# Altium project Speedometer_Tech.PrjPcb
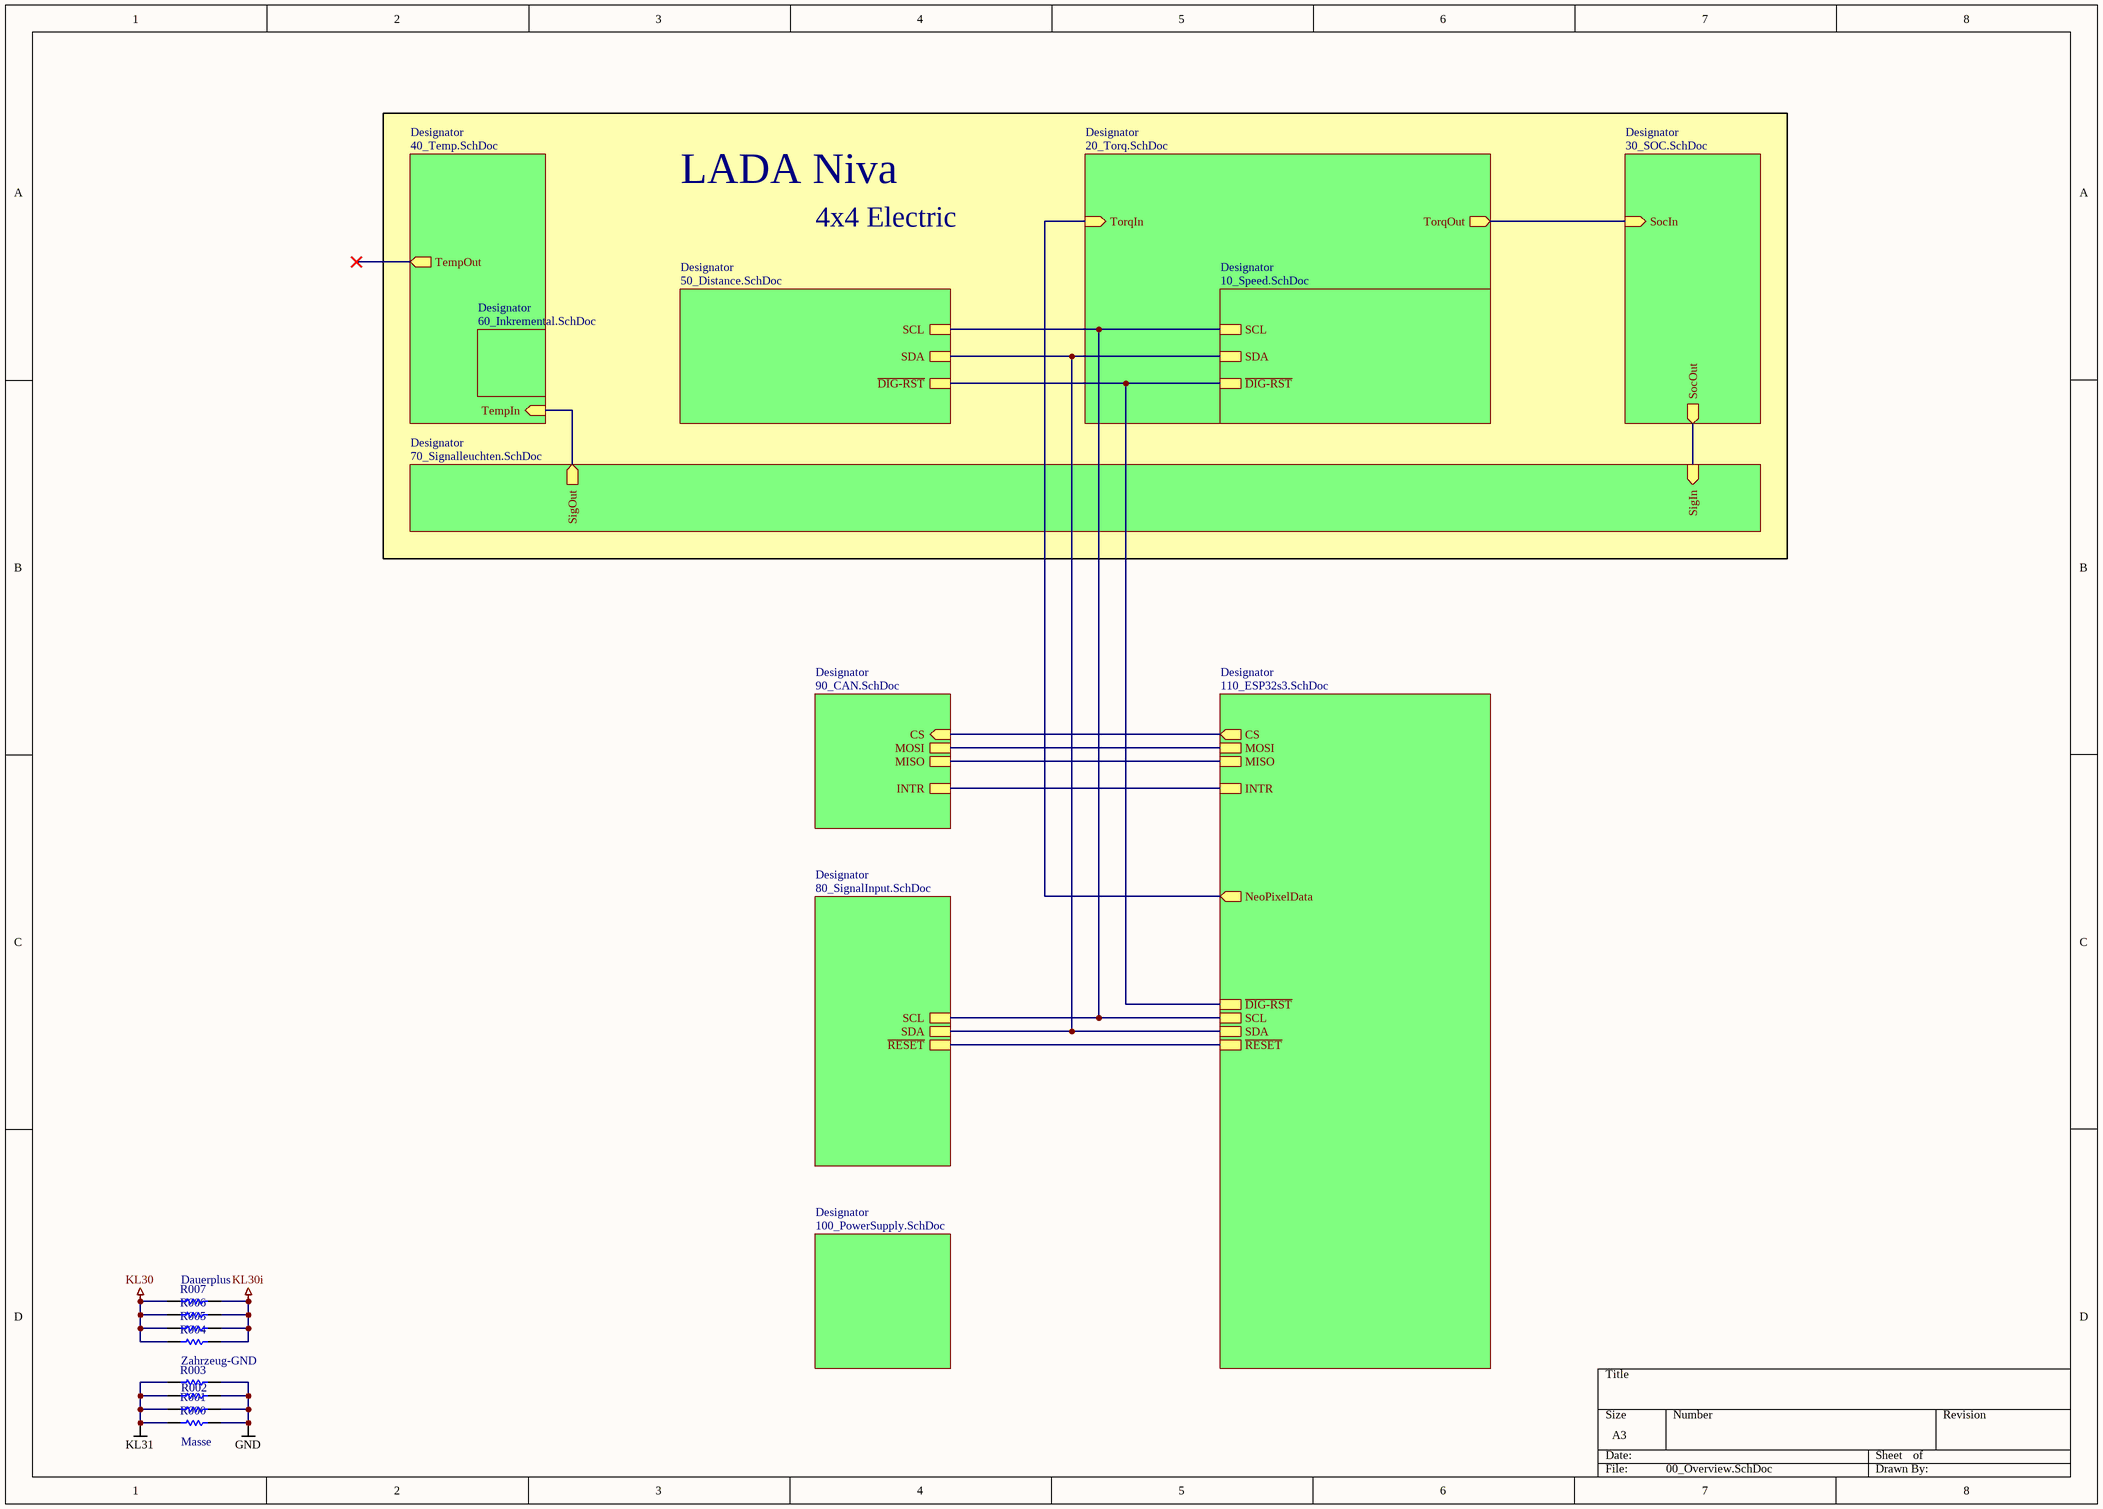
[diagram p0: 00_Overview.SchDoc]
5 sheets, 107 parts. Net scope: hierarchical (ports join the sheet entries above them; power ports are global).
Board file: Speedometer_Tech.PcbDoc
Sheets:
  00_Overview.SchDoc
    Designator = 10_Speed.SchDoc
    Designator = 50_Distance.SchDoc
    Designator = 100_PowerSupply.SchDoc
    Designator = 90_CAN.SchDoc

## Sheet 00_Overview.SchDoc
size A3; SheetNumber: 1; SheetTotal: 12

### Parts
R000  RC0603JR-070RL  [RESC1608X55X25ML10T15]  (value not drawn)
R001  RC0603JR-070RL  [RESC1608X55X25ML10T15]  (value not drawn)
R002  RC0603JR-070RL  [RESC1608X55X25ML10T15]  (value not drawn)
R003  RC0603JR-070RL  [RESC1608X55X25ML10T15]  (value not drawn)
R004  RC0603JR-070RL  [RESC1608X55X25ML10T15]  (value not drawn)
R005  RC0603JR-070RL  [RESC1608X55X25ML10T15]  (value not drawn)
R006  RC0603JR-070RL  [RESC1608X55X25ML10T15]  (value not drawn)
R007  RC0603JR-070RL  [RESC1608X55X25ML10T15]  (value not drawn)

### Sub-sheets
Designator = 110_ESP32s3.SchDoc (file not in this document): CS (out), INTR, MOSI, MISO, SCL, SDA, ~{RESET}, NeoPixelData (out), ~{DIG-RST}
Designator = 20_Torq.SchDoc (file not in this document): TorqIn (in), TorqOut (out)
Designator = 10_Speed.SchDoc: SCL, SDA, ~{DIG-RST}
Designator = 30_SOC.SchDoc (file not in this document): SocIn (in), SocOut (out)
Designator = 40_Temp.SchDoc (file not in this document): TempOut (out), TempIn (in)
Designator = 70_Signalleuchten.SchDoc (file not in this document): SigIn (in), SigOut (out)
Designator = 50_Distance.SchDoc: SCL, SDA, ~{DIG-RST}
Designator = 60_Inkremental.SchDoc (file not in this document): no entries
Designator = 80_SignalInput.SchDoc (file not in this document): SCL, SDA, ~{RESET}
Designator = 100_PowerSupply.SchDoc: no entries
Designator = 90_CAN.SchDoc: CS (in), INTR, MOSI, MISO

### Nets
GND: R000.2 R001.2 R002.2 R003.2
KL30: R004.1 R005.1 R006.1 R007.1
KL30i: R004.2 R005.2 R006.2 R007.2
KL31: R000.1 R001.1 R002.1 R003.1
~{DIG-RST}: sheet Designator/~{DIG-RST}, sheet Designator/~{DIG-RST}, sheet Designator/~{DIG-RST}
NetU100_18: sheet Designator/SCL, sheet Designator/SCL, sheet Designator/SCL, sheet Designator/SCL
NetU100_19: sheet Designator/SDA, sheet Designator/SDA, sheet Designator/SDA, sheet Designator/SDA
NetU901_12: sheet Designator/INTR, sheet Designator/INTR
NetU901_14: sheet Designator/MOSI, sheet Designator/MOSI
NetU901_15: sheet Designator/MISO, sheet Designator/MISO
NetU901_16: sheet Designator/CS, sheet Designator/CS
(unnamed): sheet Designator/~{RESET}, sheet Designator/~{RESET}
(unnamed): sheet Designator/NeoPixelData, sheet Designator/TorqIn
(unnamed): sheet Designator/TorqOut, sheet Designator/SocIn
(unnamed): sheet Designator/SocOut, sheet Designator/SigIn
(unnamed): sheet Designator/TempIn, sheet Designator/SigOut

### Notes on the sheet
- LADA Niva
- 4x4 Electric
- (near R007) Dauerplus
- Zahrzeug-GND
- (near R000) Masse

### Library data of the parts
R000 R001 R002 R003 R004 R005 R006 R007 = CMP-2100-03667-1: Chip Resistor, 0 Ohm, +/- 5%, 0.1 W, -55 to 155 degC, 0603 (1608 Metric), RoHS, Tape and Reel; Manufacturer: Yageo; Temperature Coefficient: 200ppm/degreesC; Voltage Rating: 50V; Power Rating: 100mW; Resistance: 0mOhm; Width: 0.8mm; Max Operating Temperature: 155degC; Tolerance: 5%; Package Reference: 0603; Height: 0.45mm; Depth: 0.8mm; Package Description: 2-Pin Surface Mount Device, Body 1.6 x 0.8 mm; Termination: SMD/SMT; Package Quantity: 5000; Case/Package: 0603; Case Code (Imperial): 0603; Radiation Hardening: No; Number of Pins: 2; Length: 1.6mm; Lead Free: LeadFree; Voltage Rating (DC): 50V; Military Standard: Not; Datasheet URL: http://www.yageo.com/NewPortal/yageodocoutput?fileName=/pdf/R-Chip/PYu-RC_Group_51_RoHS_L_5.pdf; Manufacturer URL: http://www.yageo.com/; Packaging: TapeandReel; Case Code (Metric): 1608; Min Operating Temperature: -55degC; Composition: ThickFilm; RoHSCompliant: true; Contact Plating: Tin; Datasheet Version: Rev. 5, 10/2016; REACH SVHC: NoSVHC

## Sheet 10_Speed.SchDoc
size A3; SheetNumber: 2; SheetTotal: 12
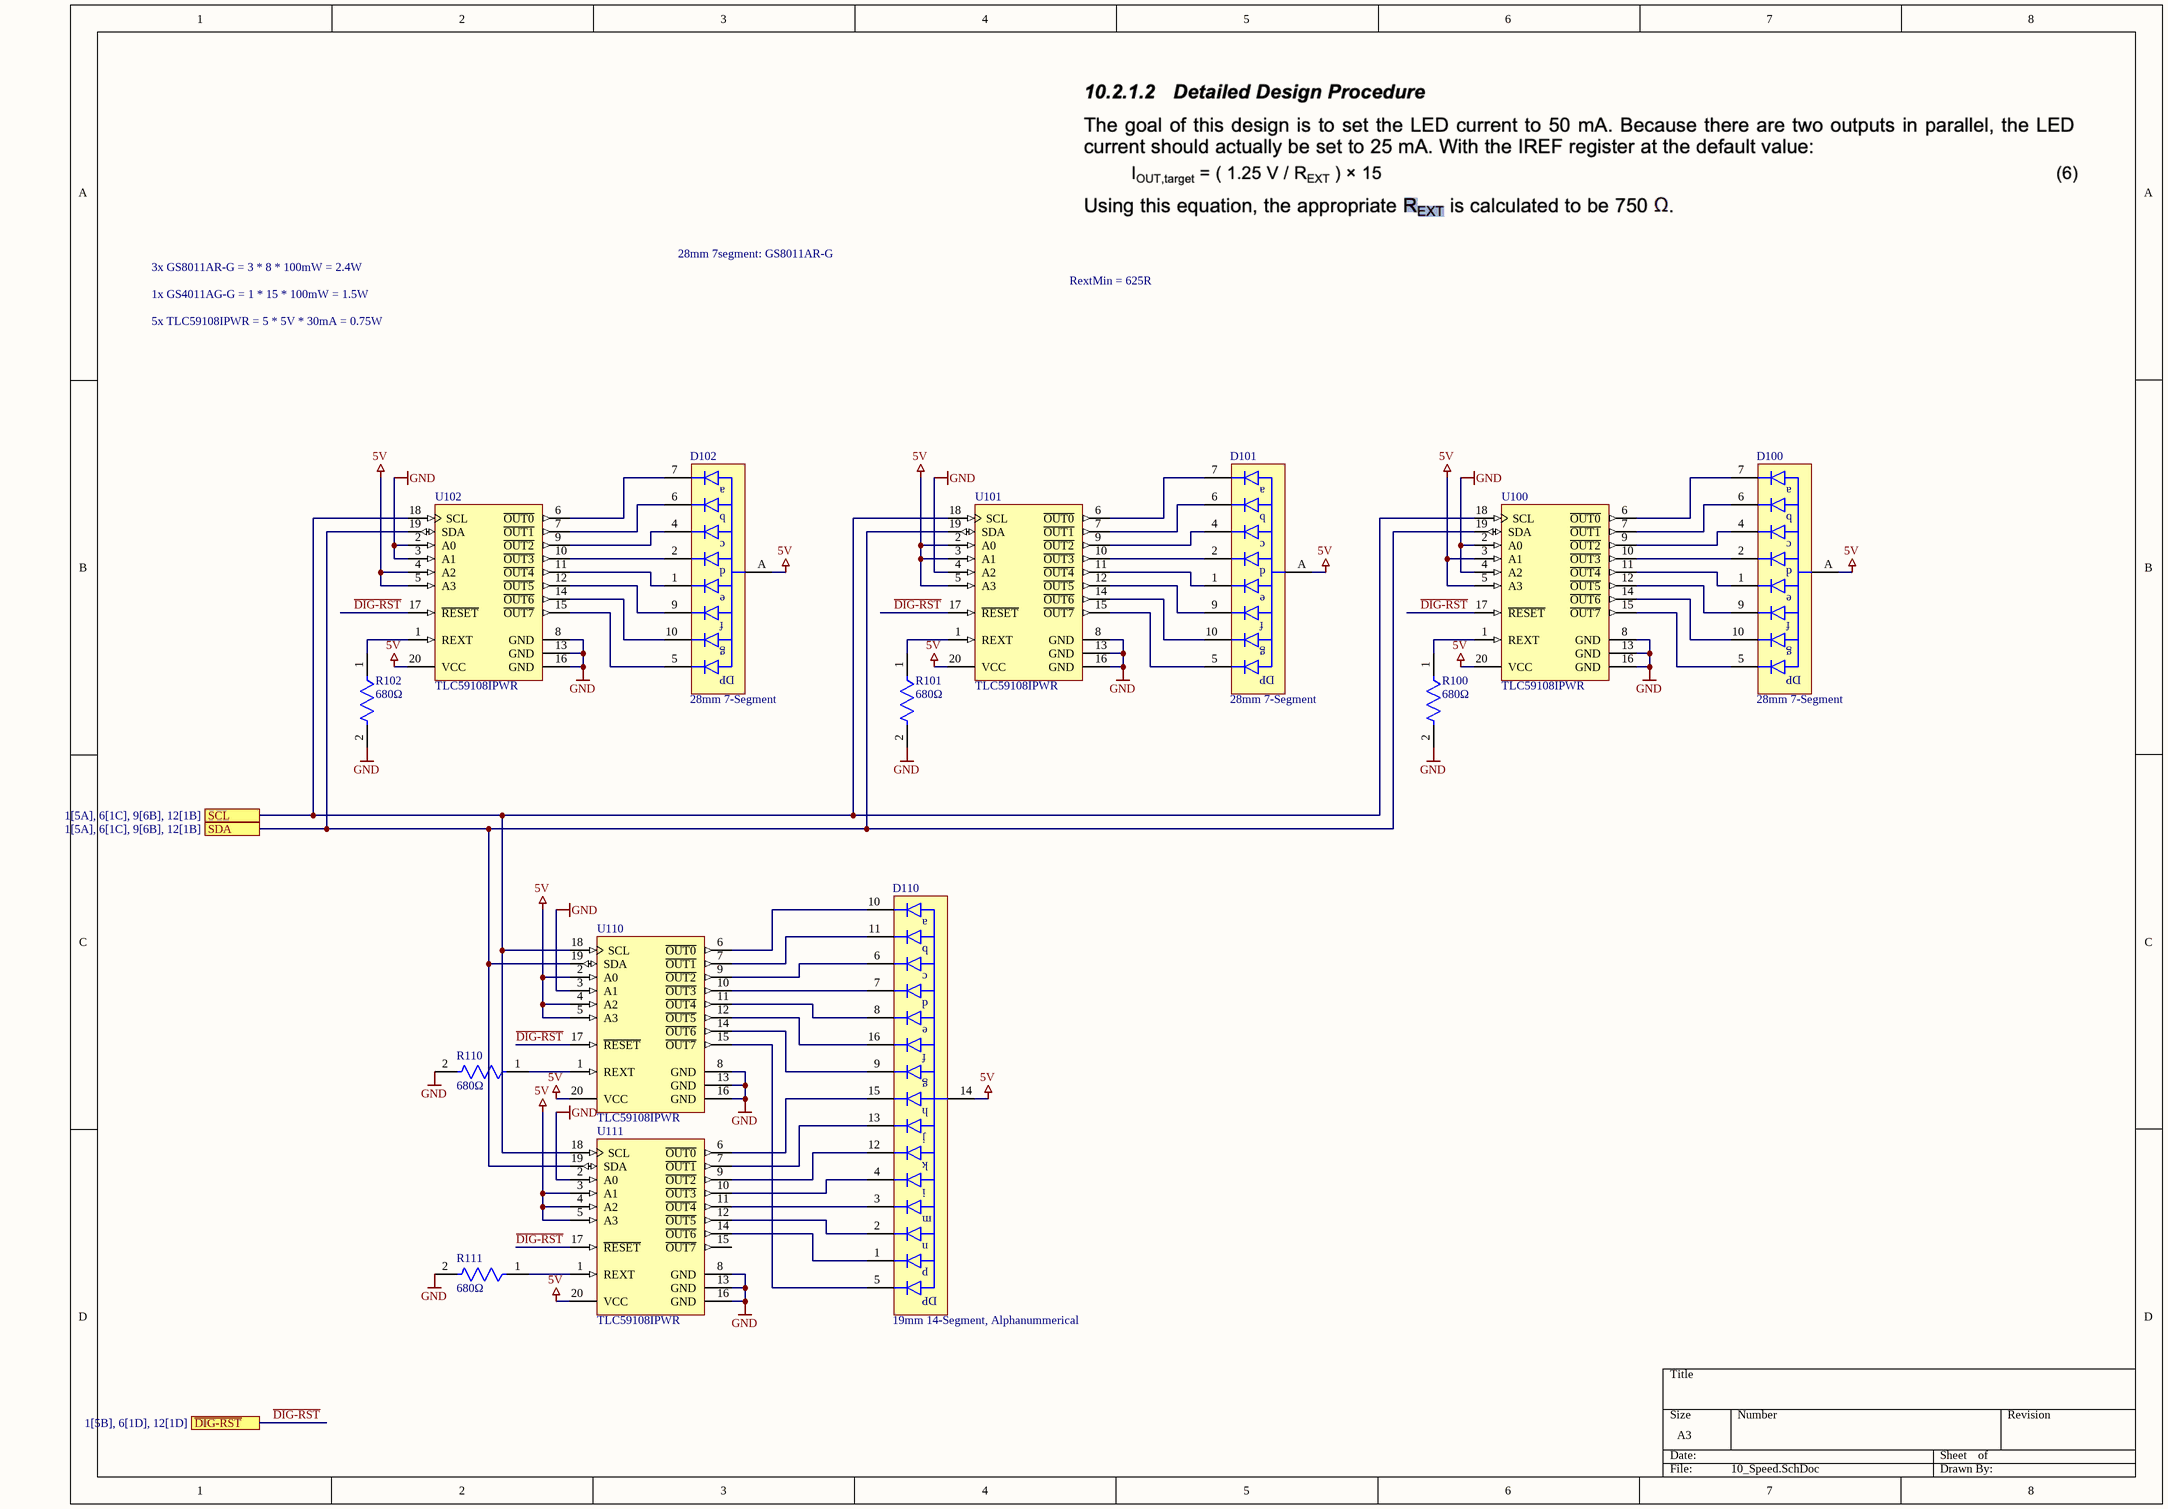
[diagram p1: 10_Speed.SchDoc]

### Parts
D100  28mm 7-Segment  [GS8011AR-G]
D101  28mm 7-Segment  [GS8011AR-G]
D102  28mm 7-Segment  [GS8011AR-G]
D110  19mm 14-Segment, Alphanummerical  [GS4011AG-G]
R100  680Ω  [FP-CRCW0603-e3-IPC_A]
R101  680Ω  [FP-CRCW0603-e3-IPC_A]
R102  680Ω  [FP-CRCW0603-e3-IPC_A]
R110  680Ω  [FP-CRCW0603-e3-IPC_A]
R111  680Ω  [FP-CRCW0603-e3-IPC_A]
U100  TLC59108IPWR  [PW0020A_M]
U101  TLC59108IPWR  [PW0020A_M]
U102  TLC59108IPWR  [PW0020A_M]
U110  TLC59108IPWR  [PW0020A_M]
U111  TLC59108IPWR  [PW0020A_M]

### Ports
SCL (see 1[5A], 6[1C], 9[6B], 12[1B]), SDA (see 1[5A], 6[1C], 9[6B], 12[1B]), ~{DIG-RST} (see 1[5B], 6[1D], 12[1D])

### Nets
5V: D100.A D101.A D102.A D110.14 U100.3(A1) U100.5(A3) U100.20(VCC) U101.2(A0) U101.3(A1) U101.5(A3) U101.20(VCC) U102.4(A2) U102.5(A3) U102.20(VCC) U110.2(A0) U110.4(A2) U110.5(A3) U110.20(VCC) U111.3(A1) U111.4(A2) U111.5(A3) U111.20(VCC)
GND: R100.2 R101.2 R102.2 R110.2 R111.2 U100.2(A0) U100.4(A2) U100.8(GND) U100.13(GND) U100.16(GND) U101.4(A2) U101.8(GND) U101.13(GND) U101.16(GND) U102.2(A0) U102.3(A1) U102.8(GND) U102.13(GND) U102.16(GND) U110.3(A1) U110.8(GND) U110.13(GND) U110.16(GND) U111.2(A0) U111.8(GND) U111.13(GND) U111.16(GND)
~{DIG-RST}: U100.17(~{RESET}) U101.17(~{RESET}) U102.17(~{RESET}) U110.17(~{RESET}) U111.17(~{RESET}) ; port ~{DIG-RST}
NetD100_1: D100.1 U100.11(~{OUT4})
NetD100_2: D100.2 U100.10(~{OUT3})
NetD100_4: D100.4 U100.9(~{OUT2})
NetD100_5: D100.5 U100.15(~{OUT7})
NetD100_6: D100.6 U100.7(~{OUT1})
NetD100_7: D100.7 U100.6(~{OUT0})
NetD100_9: D100.9 U100.12(~{OUT5})
NetD100_10: D100.10 U100.14(~{OUT6})
NetD101_1: D101.1 U101.11(~{OUT4})
NetD101_2: D101.2 U101.10(~{OUT3})
NetD101_4: D101.4 U101.9(~{OUT2})
NetD101_5: D101.5 U101.15(~{OUT7})
NetD101_6: D101.6 U101.7(~{OUT1})
NetD101_7: D101.7 U101.6(~{OUT0})
NetD101_9: D101.9 U101.12(~{OUT5})
NetD101_10: D101.10 U101.14(~{OUT6})
NetD102_1: D102.1 U102.11(~{OUT4})
NetD102_2: D102.2 U102.10(~{OUT3})
NetD102_4: D102.4 U102.9(~{OUT2})
NetD102_5: D102.5 U102.15(~{OUT7})
NetD102_6: D102.6 U102.7(~{OUT1})
NetD102_7: D102.7 U102.6(~{OUT0})
NetD102_9: D102.9 U102.12(~{OUT5})
NetD102_10: D102.10 U102.14(~{OUT6})
NetD110_1: D110.1 U111.14(~{OUT6})
NetD110_2: D110.2 U111.12(~{OUT5})
NetD110_3: D110.3 U111.11(~{OUT4})
NetD110_4: D110.4 U111.10(~{OUT3})
NetD110_5: D110.5 U110.15(~{OUT7})
NetD110_6: D110.6 U110.9(~{OUT2})
NetD110_7: D110.7 U110.10(~{OUT3})
NetD110_8: D110.8 U110.11(~{OUT4})
NetD110_9: D110.9 U110.14(~{OUT6})
NetD110_10: D110.10 U110.6(~{OUT0})
NetD110_11: D110.11 U110.7(~{OUT1})
NetD110_12: D110.12 U111.9(~{OUT2})
NetD110_13: D110.13 U111.7(~{OUT1})
NetD110_15: D110.15 U111.6(~{OUT0})
NetD110_16: D110.16 U110.12(~{OUT5})
NetR100_1: R100.1 U100.1(REXT)
NetR101_1: R101.1 U101.1(REXT)
NetR102_1: R102.1 U102.1(REXT)
NetR110_1: R110.1 U110.1(REXT)
NetR111_1: R111.1 U111.1(REXT)
NetU100_18: U100.18(SCL) U101.18(SCL) U102.18(SCL) U110.18(SCL) U111.18(SCL) ; port SCL
NetU100_19: U100.19(SDA) U101.19(SDA) U102.19(SDA) U110.19(SDA) U111.19(SDA) ; port SDA

Not connected (* = marked no-connect by the designer): U111 15(~{OUT7})

### Notes on the sheet
- 3x GS8011AR-G = 3 * 8 * 100mW = 2.4W
- 1x GS4011AG-G = 1 * 15 * 100mW = 1.5W
- 28mm 7segment: GS8011AR-G
- RextMin = 625R
- 5x TLC59108IPWR = 5 * 5V * 30mA = 0.75W
- (in symbol GS4011AG-G) a; b; c; d; e; f; g; h; j; k; i; m; n; p; DP

### Library data of the parts
D100-D102 = GS8011AR-G: SMD, 28x16.8mm 7-Segment
D110 = GS4011AG-G: SMD, 19x9.3mm 14-Segment, Alphanummerical
R100-R102 R110 R111 = CMP-2000-03530-2: RES Thick Film, 680Ω, 5%, 0.1W, 200ppm/°C, 0603 / CRCW0603680RJNEA; Power Rating: 100mW; Voltage Rating: 75V; Resistance: 680R; Max Operating Temperature: 155°C; Package Quantity: 1; Features: Automotive AEC-Q200; Composition: Thick Film; Length: 1.55mm; Voltage Rating (DC): 75V; Number of Terminations: 2; Termination: SMD/SMT; Case/Package: 0603; Height: 0.45mm; Min Operating Temperature: -55°C; Case Code (Imperial): 0603; Width: 0.033inch; Military Standard: Not; Max Power Dissipation: 100mW; Lead Free: Lead Free; Weight: 7.1E-05oz; Temperature Coefficient: 200ppm/°C; Contact Plating: Tin; Packaging: Tape and Reel; Radiation Hardening: No; Working Voltage: 75V; Tolerance: 5%; Number of Pins: 2; Depth: 0.85mm; Case Code (Metric): 1608
U100-U102 U110 U111 = CMP-0388-00397-2: 8-Bit Fast Mode Plus (FM+) I2C Bus Constant-Current LED Sink Driver, 3 to 5.5 V, -40 to 85 degC, 20-pin SOP (PW20), Green (RoHS & no Sb/Br); Manufacturer: Texas Instruments; Vin(Max)(V): 5.5; Vin(Min)(V): 3; Iout(Max)(A): 0.12; SubFamily: LED Driver; ComponentLink3URL: http://www.ti.com.cn/cn/lit/ml/mpds362/mpds362.pdf; PackageVersion: 4040064-5/G; ComponentLink1URL: http://www.ti.com/; ComponentLink2Description: Datasheet; ComponentLink2URL: http://www.ti.com/general/docs/lit/getliterature.tsp?genericPartNumber=TLC59108&fileType=pdf; PackageReference: PW0020A; PackageDescription: 20-Pin Plastic Small Outline, Body 6.5 x 4.4 mm, 0.65 mm Pitch; ComponentLink1Description: Manufacturer URL; ComponentLink3Description: Package Specification; Eco-Plan: Green (RoHS & no Sb/Br); PartNumber: TLC59108IPWR; Code_JEDEC: MO-153; DatasheetVersion: SLDS156A; Mounting Technology: Surface Mount

## Sheet 50_Distance.SchDoc
size A3; SheetNumber: 6; SheetTotal: 12
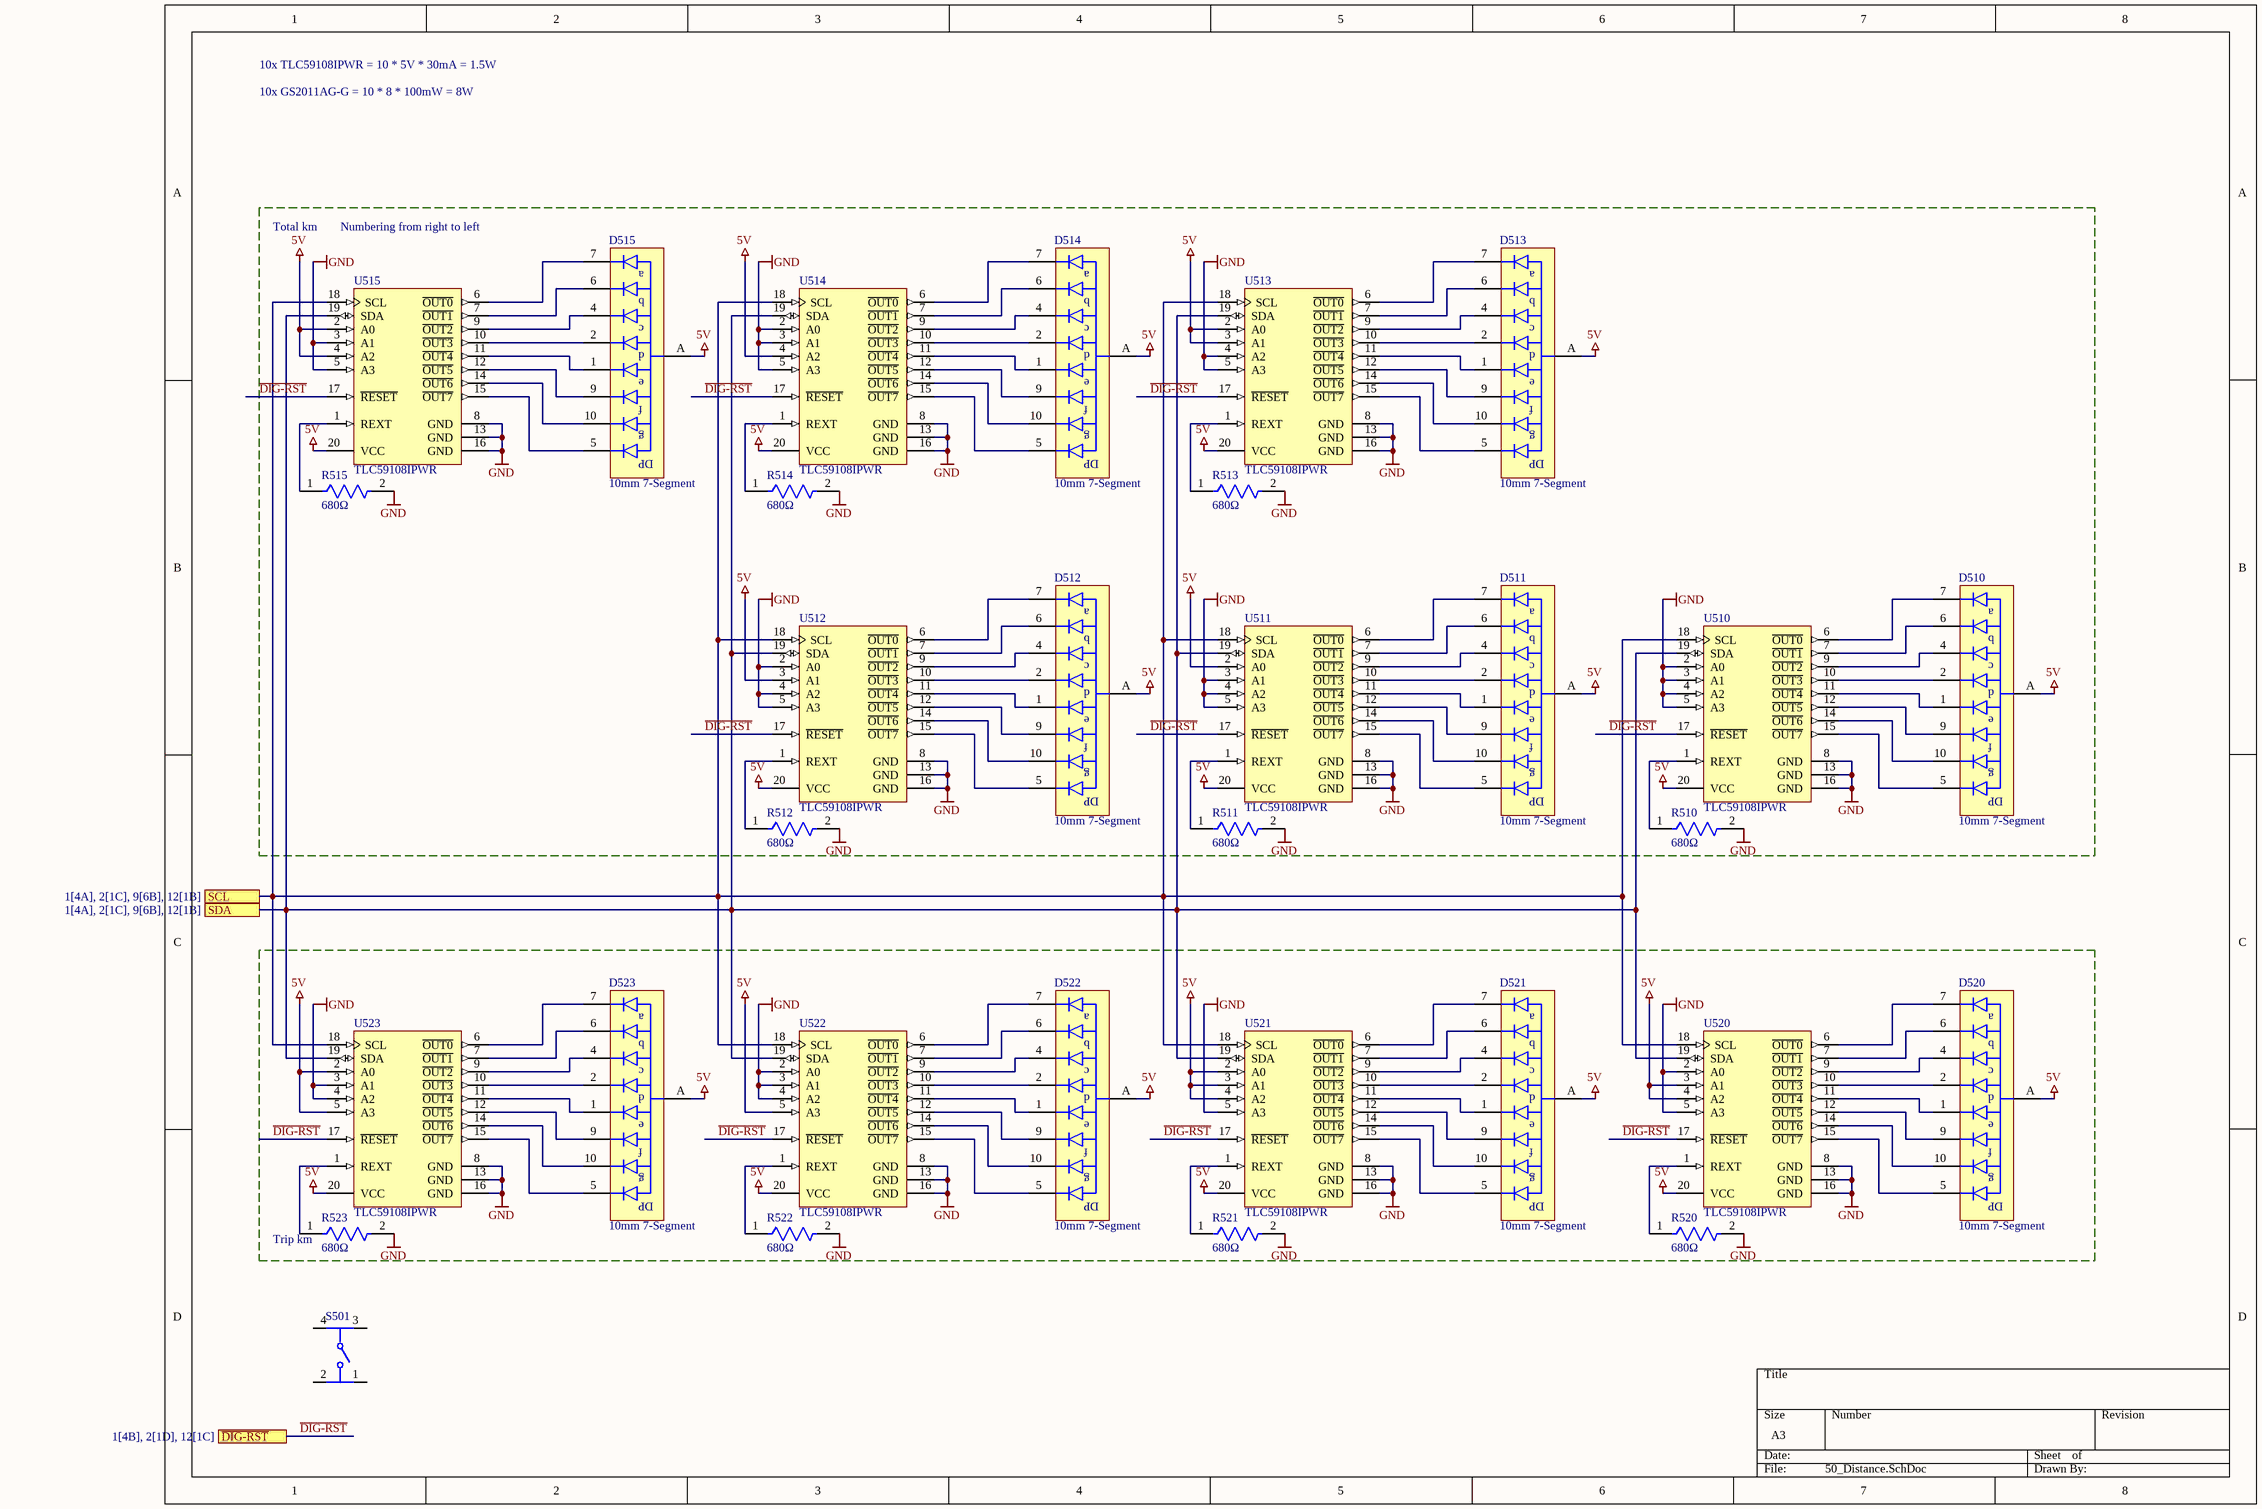
[diagram p2: 50_Distance.SchDoc]

### Parts
D510  10mm 7-Segment  [GS2011AG-G]
D511  10mm 7-Segment  [GS2011AG-G]
D512  10mm 7-Segment  [GS2011AG-G]
D513  10mm 7-Segment  [GS2011AG-G]
D514  10mm 7-Segment  [GS2011AG-G]
D515  10mm 7-Segment  [GS2011AG-G]
D520  10mm 7-Segment  [GS2011AG-G]
D521  10mm 7-Segment  [GS2011AG-G]
D522  10mm 7-Segment  [GS2011AG-G]
D523  10mm 7-Segment  [GS2011AG-G]
R510  680Ω  [FP-CRCW0603-e3-IPC_A]
R511  680Ω  [FP-CRCW0603-e3-IPC_A]
R512  680Ω  [FP-CRCW0603-e3-IPC_A]
R513  680Ω  [FP-CRCW0603-e3-IPC_A]
R514  680Ω  [FP-CRCW0603-e3-IPC_A]
R515  680Ω  [FP-CRCW0603-e3-IPC_A]
R520  680Ω  [FP-CRCW0603-e3-IPC_A]
R521  680Ω  [FP-CRCW0603-e3-IPC_A]
R522  680Ω  [FP-CRCW0603-e3-IPC_A]
R523  680Ω  [FP-CRCW0603-e3-IPC_A]
S501  (no value)  [FP-PTS645SM43SMTR92LFS-MFG]
U510  TLC59108IPWR  [PW0020A_M]
U511  TLC59108IPWR  [PW0020A_M]
U512  TLC59108IPWR  [PW0020A_M]
U513  TLC59108IPWR  [PW0020A_M]
U514  TLC59108IPWR  [PW0020A_M]
U515  TLC59108IPWR  [PW0020A_M]
U520  TLC59108IPWR  [PW0020A_M]
U521  TLC59108IPWR  [PW0020A_M]
U522  TLC59108IPWR  [PW0020A_M]
U523  TLC59108IPWR  [PW0020A_M]

### Blocks framed on the sheet
Trip km: D520-D523 R520-R523 U520-U523

### Ports
SCL (see 1[4A], 2[1C], 9[6B], 12[1B]), SDA (see 1[4A], 2[1C], 9[6B], 12[1B]), ~{DIG-RST} (see 1[4B], 2[1D], 12[1C])

### Nets
5V: D510.A D511.A D512.A D513.A D514.A D515.A D520.A D521.A D522.A D523.A U510.20(VCC) U511.2(A0) U511.20(VCC) U512.3(A1) U512.20(VCC) U513.2(A0) U513.3(A1) U513.20(VCC) U514.4(A2) U514.20(VCC) U515.2(A0) U515.4(A2) U515.20(VCC) U520.3(A1) U520.4(A2) U520.20(VCC) U521.2(A0) U521.3(A1) U521.4(A2) U521.20(VCC) U522.5(A3) U522.20(VCC) U523.2(A0) U523.5(A3) U523.20(VCC)
GND: R510.2 R511.2 R512.2 R513.2 R514.2 R515.2 R520.2 R521.2 R522.2 R523.2 U510.2(A0) U510.3(A1) U510.4(A2) U510.5(A3) U510.8(GND) U510.13(GND) U510.16(GND) U511.3(A1) U511.4(A2) U511.5(A3) U511.8(GND) U511.13(GND) U511.16(GND) U512.2(A0) U512.4(A2) U512.5(A3) U512.8(GND) U512.13(GND) U512.16(GND) U513.4(A2) U513.5(A3) U513.8(GND) U513.13(GND) U513.16(GND) U514.2(A0) U514.3(A1) U514.5(A3) U514.8(GND) U514.13(GND) U514.16(GND) U515.3(A1) U515.5(A3) U515.8(GND) U515.13(GND) U515.16(GND) U520.2(A0) U520.5(A3) U520.8(GND) U520.13(GND) U520.16(GND) U521.5(A3) U521.8(GND) U521.13(GND) U521.16(GND) U522.2(A0) U522.3(A1) U522.4(A2) U522.8(GND) U522.13(GND) U522.16(GND) U523.3(A1) U523.4(A2) U523.8(GND) U523.13(GND) U523.16(GND)
~{DIG-RST}: U510.17(~{RESET}) U511.17(~{RESET}) U512.17(~{RESET}) U513.17(~{RESET}) U514.17(~{RESET}) U515.17(~{RESET}) U520.17(~{RESET}) U521.17(~{RESET}) U522.17(~{RESET}) U523.17(~{RESET}) ; port ~{DIG-RST}
NetD510_1: D510.1 U510.11(~{OUT4})
NetD510_2: D510.2 U510.10(~{OUT3})
NetD510_4: D510.4 U510.9(~{OUT2})
NetD510_5: D510.5 U510.15(~{OUT7})
NetD510_6: D510.6 U510.7(~{OUT1})
NetD510_7: D510.7 U510.6(~{OUT0})
NetD510_9: D510.9 U510.12(~{OUT5})
NetD510_10: D510.10 U510.14(~{OUT6})
NetD511_1: D511.1 U511.11(~{OUT4})
NetD511_2: D511.2 U511.10(~{OUT3})
NetD511_4: D511.4 U511.9(~{OUT2})
NetD511_5: D511.5 U511.15(~{OUT7})
NetD511_6: D511.6 U511.7(~{OUT1})
NetD511_7: D511.7 U511.6(~{OUT0})
NetD511_9: D511.9 U511.12(~{OUT5})
NetD511_10: D511.10 U511.14(~{OUT6})
NetD512_1: D512.1 U512.11(~{OUT4})
NetD512_2: D512.2 U512.10(~{OUT3})
NetD512_4: D512.4 U512.9(~{OUT2})
NetD512_5: D512.5 U512.15(~{OUT7})
NetD512_6: D512.6 U512.7(~{OUT1})
NetD512_7: D512.7 U512.6(~{OUT0})
NetD512_9: D512.9 U512.12(~{OUT5})
NetD512_10: D512.10 U512.14(~{OUT6})
NetD513_1: D513.1 U513.11(~{OUT4})
NetD513_2: D513.2 U513.10(~{OUT3})
NetD513_4: D513.4 U513.9(~{OUT2})
NetD513_5: D513.5 U513.15(~{OUT7})
NetD513_6: D513.6 U513.7(~{OUT1})
NetD513_7: D513.7 U513.6(~{OUT0})
NetD513_9: D513.9 U513.12(~{OUT5})
NetD513_10: D513.10 U513.14(~{OUT6})
NetD514_1: D514.1 U514.11(~{OUT4})
NetD514_2: D514.2 U514.10(~{OUT3})
NetD514_4: D514.4 U514.9(~{OUT2})
NetD514_5: D514.5 U514.15(~{OUT7})
NetD514_6: D514.6 U514.7(~{OUT1})
NetD514_7: D514.7 U514.6(~{OUT0})
NetD514_9: D514.9 U514.12(~{OUT5})
NetD514_10: D514.10 U514.14(~{OUT6})
NetD515_1: D515.1 U515.11(~{OUT4})
NetD515_2: D515.2 U515.10(~{OUT3})
NetD515_4: D515.4 U515.9(~{OUT2})
NetD515_5: D515.5 U515.15(~{OUT7})
NetD515_6: D515.6 U515.7(~{OUT1})
NetD515_7: D515.7 U515.6(~{OUT0})
NetD515_9: D515.9 U515.12(~{OUT5})
NetD515_10: D515.10 U515.14(~{OUT6})
NetD520_1: D520.1 U520.11(~{OUT4})
NetD520_2: D520.2 U520.10(~{OUT3})
NetD520_4: D520.4 U520.9(~{OUT2})
NetD520_5: D520.5 U520.15(~{OUT7})
NetD520_6: D520.6 U520.7(~{OUT1})
NetD520_7: D520.7 U520.6(~{OUT0})
NetD520_9: D520.9 U520.12(~{OUT5})
NetD520_10: D520.10 U520.14(~{OUT6})
NetD521_1: D521.1 U521.11(~{OUT4})
NetD521_2: D521.2 U521.10(~{OUT3})
NetD521_4: D521.4 U521.9(~{OUT2})
NetD521_5: D521.5 U521.15(~{OUT7})
NetD521_6: D521.6 U521.7(~{OUT1})
NetD521_7: D521.7 U521.6(~{OUT0})
NetD521_9: D521.9 U521.12(~{OUT5})
NetD521_10: D521.10 U521.14(~{OUT6})
NetD522_1: D522.1 U522.11(~{OUT4})
NetD522_2: D522.2 U522.10(~{OUT3})
NetD522_4: D522.4 U522.9(~{OUT2})
NetD522_5: D522.5 U522.15(~{OUT7})
NetD522_6: D522.6 U522.7(~{OUT1})
NetD522_7: D522.7 U522.6(~{OUT0})
NetD522_9: D522.9 U522.12(~{OUT5})
NetD522_10: D522.10 U522.14(~{OUT6})
NetD523_1: D523.1 U523.11(~{OUT4})
NetD523_2: D523.2 U523.10(~{OUT3})
NetD523_4: D523.4 U523.9(~{OUT2})
NetD523_5: D523.5 U523.15(~{OUT7})
NetD523_6: D523.6 U523.7(~{OUT1})
NetD523_7: D523.7 U523.6(~{OUT0})
NetD523_9: D523.9 U523.12(~{OUT5})
NetD523_10: D523.10 U523.14(~{OUT6})
NetR510_1: R510.1 U510.1(REXT)
NetR511_1: R511.1 U511.1(REXT)
NetR512_1: R512.1 U512.1(REXT)
NetR513_1: R513.1 U513.1(REXT)
NetR514_1: R514.1 U514.1(REXT)
NetR515_1: R515.1 U515.1(REXT)
NetR520_1: R520.1 U520.1(REXT)
NetR521_1: R521.1 U521.1(REXT)
NetR522_1: R522.1 U522.1(REXT)
NetR523_1: R523.1 U523.1(REXT)
NetU100_18: U510.18(SCL) U511.18(SCL) U512.18(SCL) U513.18(SCL) U514.18(SCL) U515.18(SCL) U520.18(SCL) U521.18(SCL) U522.18(SCL) U523.18(SCL) ; port SCL
NetU100_19: U510.19(SDA) U511.19(SDA) U512.19(SDA) U513.19(SDA) U514.19(SDA) U515.19(SDA) U520.19(SDA) U521.19(SDA) U522.19(SDA) U523.19(SDA) ; port SDA

Not connected (* = marked no-connect by the designer): S501 1 2 3 4

### Notes on the sheet
- 10x TLC59108IPWR = 10 * 5V * 30mA = 1.5W
- 10x GS2011AG-G = 10 * 8 * 100mW = 8W
- Total km
- Numbering from right to left
- (in symbol GS2011AG-G) a; b; c; d; e; f; g; DP

### Library data of the parts
D510-D515 D520-D523 = GS2011AG-G: SMD, 10x6.9mm 7-Segment
R510-R515 R520-R523 = CMP-2000-03530-2: as R100 on sheet 10_Speed; Max Operating Temperature: 155°C; Package Quantity: 1; Features: Automotive AEC-Q200; Composition: Thick Film; Length: 1.55mm; Voltage Rating (DC): 75V; Number of Terminations: 2; Termination: SMD/SMT; Case/Package: 0603; Height: 0.45mm; Min Operating Temperature: -55°C; Case Code (Imperial): 0603; Width: 0.033inch; Military Standard: Not; Max Power Dissipation: 100mW; Lead Free: Lead Free; Weight: 7.1E-05oz; Temperature Coefficient: 200ppm/°C; Contact Plating: Tin; Packaging: Tape and Reel; Radiation Hardening: No; Working Voltage: 75V; Tolerance: 5%; Number of Pins: 2; Depth: 0.85mm; Case Code (Metric): 1608
S501 = CMP-2000-05160-2: SWITCH TACTILE SPST-NO 0.05A 12V / PTS645SM43SMTR92LFS; Contact Resistance: 100mR; Throw Configuration: SPST; Illumination Type: Non-Illuminated; Mechanical Life: 100000Cycles; Current Rating: 50mA; Switch Function: Off-Mom; Actuator Length: 0.85mm; Actuator Material: Nylon; Actuator Type: Standard; Operating Force: 160gf; Min Operating Temperature: -20°C; REACH SVHC: No SVHC; Termination: Gull Wing; Case/Package: SMD/SMT; Packaging: Tape and Reel; Mount: Surface Mount; Voltage Rating (DC): 12V; Orientation: Straight; Lead Free: Lead Free; Contact Material: Silver; Color: Black; Max Current Rating: 50mA; Contact Plating: Silver; Depth: 9mm; Package Quantity: 1; Max Voltage Rating (DC): 12V; Length: 6mm; Max Operating Temperature: 60°C
U510-U515 U520-U523 = CMP-0388-00397-2: as U100 on sheet 10_Speed; ComponentLink3URL: http://www.ti.com.cn/cn/lit/ml/mpds362/mpds362.pdf; PackageVersion: 4040064-5/G; ComponentLink1URL: http://www.ti.com/; ComponentLink2Description: Datasheet; ComponentLink2URL: http://www.ti.com/general/docs/lit/getliterature.tsp?genericPartNumber=TLC59108&fileType=pdf; PackageReference: PW0020A; PackageDescription: 20-Pin Plastic Small Outline, Body 6.5 x 4.4 mm, 0.65 mm Pitch; ComponentLink1Description: Manufacturer URL; ComponentLink3Description: Package Specification; Eco-Plan: Green (RoHS & no Sb/Br); PartNumber: TLC59108IPWR; Code_JEDEC: MO-153; DatasheetVersion: SLDS156A; Mounting Technology: Surface Mount

## Sheet 100_PowerSupply.SchDoc
size A3; SheetNumber: 11; SheetTotal: 12
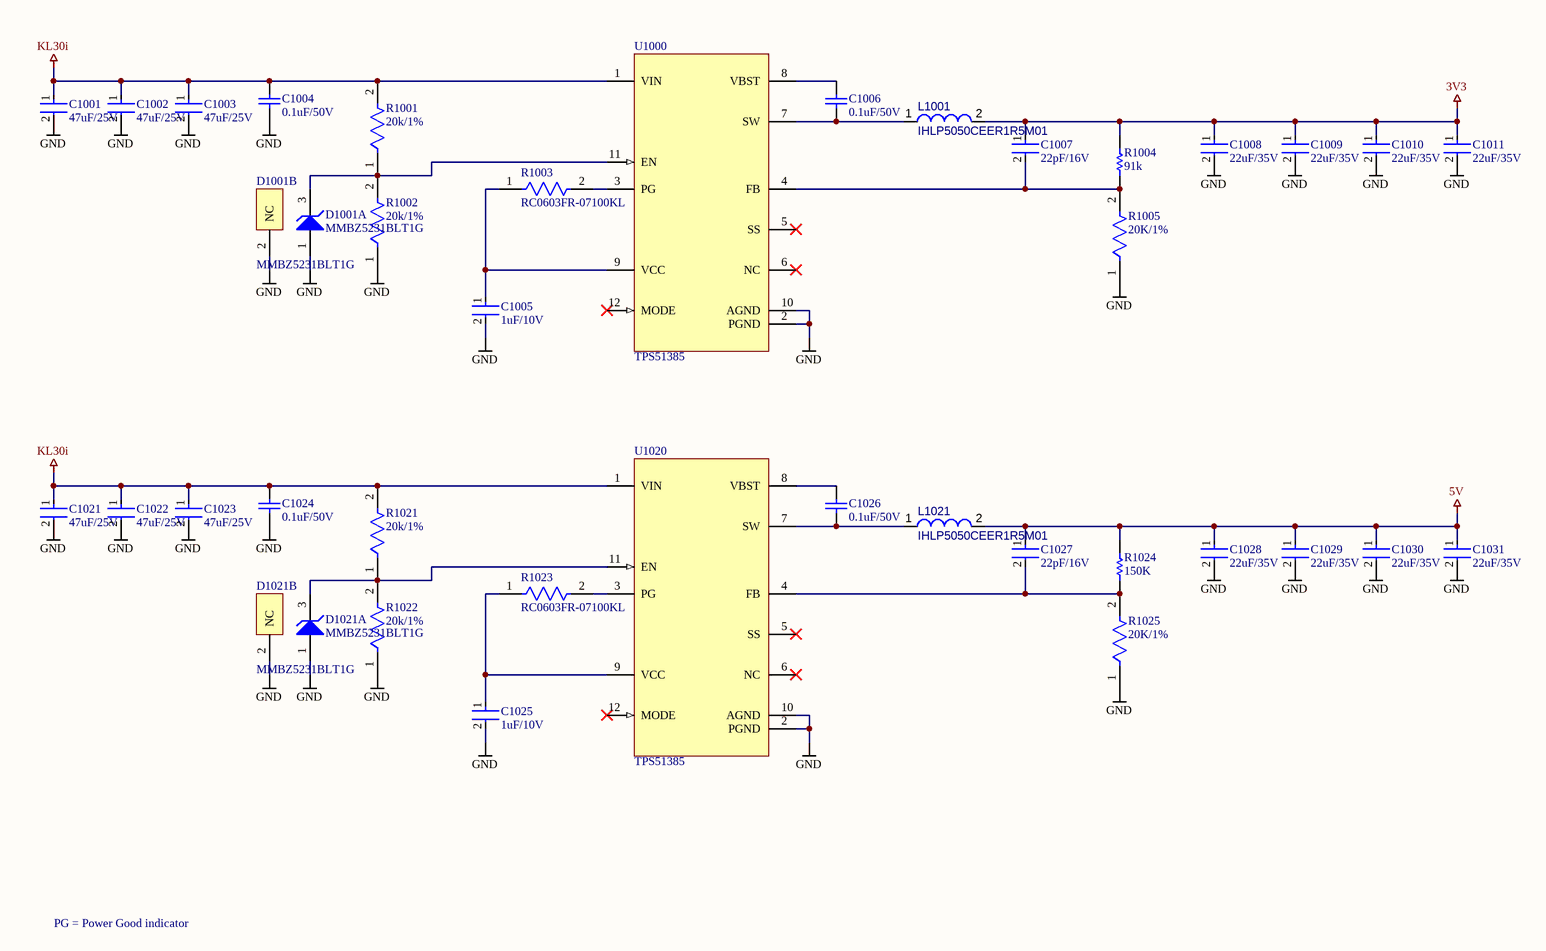
[diagram p3: 100_PowerSupply.SchDoc]

### Parts
C1001  47uF/25V  [FP-C3216-160-0_2-MFG]
C1002  47uF/25V  [FP-C3216-160-0_2-MFG]
C1003  47uF/25V  [FP-C3216-160-0_2-MFG]
C1004  0.1uF/50V  [CAPC2013X135X45ML10T25]
C1005  1uF/10V  [FP-C0603-CG-MFG]
C1006  0.1uF/50V  [CAPC2013X135X45ML10T25]
C1007  22pF/16V  [FP-C0603C-CF-MFG]
C1008  22uF/35V  [FP-C3216-160-0_2-IPC_B]
C1009  22uF/35V  [FP-C3216-160-0_2-IPC_B]
C1010  22uF/35V  [FP-C3216-160-0_2-IPC_B]
C1011  22uF/35V  [FP-C3216-160-0_2-IPC_B]
C1021  47uF/25V  [FP-C3216-160-0_2-MFG]
C1022  47uF/25V  [FP-C3216-160-0_2-MFG]
C1023  47uF/25V  [FP-C3216-160-0_2-MFG]
C1024  0.1uF/50V  [CAPC2013X135X45ML10T25]
C1025  1uF/10V  [FP-C0603-CG-MFG]
C1026  0.1uF/50V  [CAPC2013X135X45ML10T25]
C1027  22pF/16V  [FP-C0603C-CF-MFG]
C1028  22uF/35V  [FP-C3216-160-0_2-IPC_B]
C1029  22uF/35V  [FP-C3216-160-0_2-IPC_B]
C1030  22uF/35V  [FP-C3216-160-0_2-IPC_B]
C1031  22uF/35V  [FP-C3216-160-0_2-IPC_B]
D1001  MMBZ5231BLT1G  [ONSC-SOT-23-3-318-08_V]  (parts A,B of 2)
D1021  MMBZ5231BLT1G  [ONSC-SOT-23-3-318-08_V]  (parts A,B of 2)
L1001  IHLP5050CEER1R5M01  [IHLP5050CEER1R5M01]
L1021  IHLP5050CEER1R5M01  [IHLP5050CEER1R5M01]
R1001  20k/1%  [FP-RC0603-0_55-IPC_C]
R1002  20k/1%  [FP-RC0603-0_55-IPC_C]
R1003  RC0603FR-07100KL  [FP-RC0603-0_55-MFG]
R1004  91k  [RESC1609X50X30NL10T20]
R1005  20K/1%  [FP-RC0603-0_55-IPC_C]
R1021  20k/1%  [FP-RC0603-0_55-IPC_C]
R1022  20k/1%  [FP-RC0603-0_55-IPC_C]
R1023  RC0603FR-07100KL  [FP-RC0603-0_55-MFG]
R1024  150K  [RESC1608X55X30NL15T15]
R1025  20K/1%  [FP-RC0603-0_55-IPC_C]
U1000  TPS51385  [TPS51386]
U1020  TPS51385  [TPS51386]

### Nets
3V3: C1007.1 C1008.1 C1009.1 C1010.1 C1011.1 L1001.2 R1004.2
5V: C1027.1 C1028.1 C1029.1 C1030.1 C1031.1 L1021.2 R1024.2
GND: C1001.2 C1002.2 C1003.2 C1004.1 C1005.2 C1008.2 C1009.2 C1010.2 C1011.2 C1021.2 C1022.2 C1023.2 C1024.1 C1025.2 C1028.2 C1029.2 C1030.2 C1031.2 D1001.1(A) D1001.2(NC) D1021.1(A) D1021.2(NC) R1002.1 R1005.1 R1022.1 R1025.1 U1000.2(PGND) U1000.10(AGND) U1020.2(PGND) U1020.10(AGND)
KL30i: C1001.1 C1002.1 C1003.1 C1004.2 C1021.1 C1022.1 C1023.1 C1024.2 R1001.2 R1021.2 U1000.1(VIN) U1020.1(VIN)
NetC1005_1: C1005.1 R1003.1 U1000.9(VCC)
NetC1006_1: C1006.1 L1001.1 U1000.7(SW)
NetC1006_2: C1006.2 U1000.8(VBST)
NetC1007_2: C1007.2 R1004.1 R1005.2 U1000.4(FB)
NetC1025_1: C1025.1 R1023.1 U1020.9(VCC)
NetC1026_1: C1026.1 L1021.1 U1020.7(SW)
NetC1026_2: C1026.2 U1020.8(VBST)
NetC1027_2: C1027.2 R1024.1 R1025.2 U1020.4(FB)
NetD1001_3: D1001.3(K) R1001.1 R1002.2 U1000.11(EN)
NetD1021_3: D1021.3(K) R1021.1 R1022.2 U1020.11(EN)
NetR1003_2: R1003.2 U1000.3(PG)
NetR1023_2: R1023.2 U1020.3(PG)

Not connected (* = marked no-connect by the designer): U1000 5(SS)* 6(NC)* 12(MODE)*; U1020 5(SS)* 6(NC)* 12(MODE)*

### Notes on the sheet
- PG = Power Good indicator

### Library data of the parts
C1001-C1003 C1021-C1023 = CMP-2000-05397-3: Multilayer Ceramic Capacitors 47uF ±20% 25V X5R SMD 1206 / C3216X5R1E476M160AC; Weight: 0.000571oz; Dielectric: X5R; Length: 0.126inch; Voltage Rating: 25V; Case/Package: 1206; Dielectric Material: Ceramic; Min Operating Temperature: -55°C; Lead Free: Lead Free; Packaging: Tape and Reel; Package Quantity: 1; Mount: Surface Mount; Depth: 1.6mm; REACH SVHC: No SVHC; Termination: SMD/SMT; Case Code (Imperial): 1206; Series: C; Resistor Type: Ceramic; Voltage: 25V; Width: 0.063inch; Height: 1.6mm; Tolerance: 20%; Capacitance: 47uF; Max Operating Temperature: 85°C; Voltage Rating (DC): 25V; RoHS Compliant: Yes; Thickness: 0.071inch; Case Code (Metric): 3216
C1004 C1006 C1024 C1026 = CMP-2100-03644-1: Chip Capacitor, 0.1 uF, +/- 10%, 50 V, -55 to 125 degC, 0805 (2012 Metric), RoHS, Tape and Reel / GRM21BR71H104KA01L; Manufacturer: Murata; Voltage: 50V; Capacitance: 100nF; Insulation Resistance: 10GR; Dielectric Material: Ceramic; Dielectric: X7R; Package Description: 2-Pin Surface Mount Device, Body 2 x 1.25 mm; Manufacturer URL: http://www.murata.com/; Case Code (Imperial): 0805; Datasheet URL: http://psearch.en.murata.com/capacitor/product/GRM21BR71H104KA01%23.pdf; Termination: SMD/SMT; Lead Free: LeadFree; Package Quantity: 1; Mount: SurfaceMount; REACH SVHC: Unknown; Thickness: 0.053inch; Height: 1.25mm; Case/Package: 0805; Voltage Rating: 50V; Width: 0.049inch; Case Code (Metric): 2012; Material: Ceramic; Min Operating Temperature: -55degC; RoHSCompliant: true; Datasheet Version: 42675.0; Voltage Rating (DC): 50V; Tolerance: 10%; Package Reference: 0805; Depth: 1.25mm; Length: 2mm; Max Operating Temperature: 125degC; Packaging: TapeandReel; Number of Pins: 2; Radiation Hardening: No
C1005 C1025 = CMP-2006-02243-2: CAP CER 1UF 10V Y5V 0603 / C0603C105Z8VACTU; Dielectric Material: Ceramic; Tolerance: 80%; Dissipation Factor: 10%; Case/Package: 0603; Width: 0.8mm; Radiation Hardening: No; Lead Pitch: 0.7mm; Termination: SMD/SMT; Min Operating Temperature: -30°C; Voltage Rating (DC): 10V; Length: 1.6mm; Packaging: Tape and Reel; Mount: Surface Mount; REACH SVHC: No SVHC; Series: C; Case Code (Imperial): 0603; Package Quantity: 1; Thickness: 0.035inch; Capacitance: 1uF; Height: 0.8mm; Dielectric: Y5V; Construction: Flat; Lead Free: Lead Free; Case Code (Metric): 1608; Max Operating Temperature: 85°C; Voltage Rating: 10V; Depth: 0.8mm; RoHS Compliant: Yes
C1007 C1027 = CMP-2006-03465-2: CAP CER 22PF 16V 10% NP0 0603 / C0603C220K4GACTU; Manufacturer: KEMET; Temperature Characteristic: C0G; Temperature Coefficient: 30ppm/°C; Tolerance: 0.1; Material: Ceramic; Automotive Grade: Grade 1; ComponentLink2URL: https://api.kemet.com/component-edge/download/datasheet/C0603C100J5GACAUTO.pdf; Mouser Description: Multilayer Ceramic Capacitors MLCC - SMD/SMT 16volts 22pF C0G 10%; Package: C0603C-CF; Height: 0.87mm; Device Class L1: Passive Components; ComponentLink2Description: Datasheet; Device Class L3: Ceramic Capacitors; Device Class L2: Capacitors; Value: 22 pF; Temperature Range High: +125°C; Automotive: Yes; Digikey Description: CAP CER 22PF 16V 10% NP0 0603; Category: Cap; Capacitance: 22 pF; Manufacturer Part Number: C0603C220K4GACTU; RoHS: TRUE; Octopart: https://octopart.com/c0603c220k4gactu-kemet-17097913; Temperature: -55°C to +125°C; Lead Free: Yes; Temperature Range Low: -55°C; Voltage Rating: 16 V
C1008-C1011 C1028-C1031 = CMP-2000-05398-2: Multilayer Ceramic Capacitors 22uF ±20% 35V X5R SMD 1206 / C3216X5R1V226M160AC; Mount: Surface Mount; Voltage Rating: 35V; Length: 3.2mm; Case/Package: 1206; Width: 0.063inch; Dielectric Material: Ceramic; Series: C; Voltage Rating (DC): 35V; Construction: Flat; Tolerance: 20%; Dielectric: X5R; Voltage: 35V; Min Operating Temperature: -55°C; Case Code (Metric): 3216; Termination: SMD/SMT; Capacitance: 22uF; Resistor Type: Ceramic; RoHS Compliant: Yes; Height: 1.6mm; Depth: 1.6mm; Radiation Hardening: No; Package Quantity: 2000; REACH SVHC: No SVHC; Case Code (Imperial): 1206; Weight: 0.000571oz; Max Operating Temperature: 85°C; Packaging: Tape and Reel; Thickness: 1.6mm; Lead Free: Lead Free
D1001 D1021 = CMP-1060-00985-1: Zener Voltage Regulator, 225 mW, 3-Pin SOT-23, Pb-Free, Tape and Reel; Manufacturer: On Semiconductor; VZ Typ (V): 5.1; Packing: Tape and Reel; ComponentLink1Description: Manufacturer URL; PartNumber: MMBZ5231BLT1G; PackageReference: SOT-23-3-318-08; ComponentLink1URL: http://www.onsemi.com/; ComponentLink3URL: http://www.onsemi.cn/pub_link/Collateral/318-08.PDF; Mounting Technology: Surface Mount; ComponentLink2Description: Datasheet; DatasheetVersion: Rev. 12; ComponentLink3Description: Package Specification; PackageVersion: Rev. AP, 11/2009; ComponentLink2URL: http://www.onsemi.cn/pub_link/Collateral/MMBZ5221BLT1-D.PDF; RoHS: Pb-Free; PackageDescription: 3-Pin Small Outline Transistor, Body 2.92 x 1.3 mm, Pitch 0.95 mm
L1001 L1021 = IHLP5050CEER1R5M01: Chip Inductor, 1.5 uH, +/- 20% / IHLP5050CEER1R5M01
R1001 R1002 R1005 R1021 R1022 R1025 = CMP-2000-06932-2: RES 20K OHM 1% 1/10W 0603 / RC0603FR-0720KL; Voltage Rating: 50V; Temperature Coefficient: 100ppm/°C; Power Rating: 100mW; Resistance: 20kR; Height: 0.022inch; REACH SVHC: No SVHC; Case Code (Metric): 1608; Depth: 0.8mm; Tolerance: 1%; Min Operating Temperature: -55°C; Series: RC; RoHS Compliant: Yes; Resistor Type: Thick Film; Max Power Dissipation: 100mW; Features: Moisture Resistant; Max Operating Temperature: 155°C; Package Quantity: 1; Size Code: 0603; Packaging: Tape and Reel; Width: 0.031inch; Length: 0.063inch; Military Standard: Not; Technology: THICK FILM; Number of Terminations: 2; Termination: SMD/SMT; Construction: Rectangular; Case/Package: 0603; Number of Pins: 2; Lead Free: Lead Free; Voltage Rating (DC): 50V; Resistance Tolerance: 1%; Case Code (Imperial): 0603
R1003 R1023 = CMP-2100-03662-2: RES SMD 100K OHM 1% 1/10W 0603; Voltage Rating (DC): 50V; Resistance: 100kR; Max Power Dissipation: 100mW; Temperature Coefficient: 100ppm/°C; Working Voltage: 75V; Length: 1.6mm; Lead Free: Lead Free; Number of Terminations: 2; Packaging: Tape and Reel; Voltage Rating: 50V; Termination: SMD/SMT; Width: 0.8mm; Resistor Type: Thick Film; Resistance Tolerance: 1%; Features: Moisture Resistant; Height: 0.45mm; Construction: Rectangular; Case/Package: 0603; Military Standard: Not; Case Code (Imperial): 0603; Series: RC; Technology: THICK FILM; Depth: 0.8mm; RoHS Compliant: Yes; REACH SVHC: No SVHC; Min Operating Temperature: -55°C; Case Code (Metric): 1608; Max Operating Temperature: 155°C; Power Rating: 100mW; Number of Pins: 2; Tolerance: 1%
R1004 = CMP-2000-03640-1: CRCW060391K0FKEA; Manufacturer: Vishay Dale; Part Number: CRCW060391K0FKEA
R1024 = CMP-1012-00754-2: ERJ-3EKF1503V; Manufacturer: Panasonic; Part Number: ERJ-3EKF1503V
U1000 U1020 = TPS51386: 8A Synchronous Buck Converter - TPS51386

## Sheet 90_CAN.SchDoc
size A4; SheetNumber: 10; SheetTotal: 12
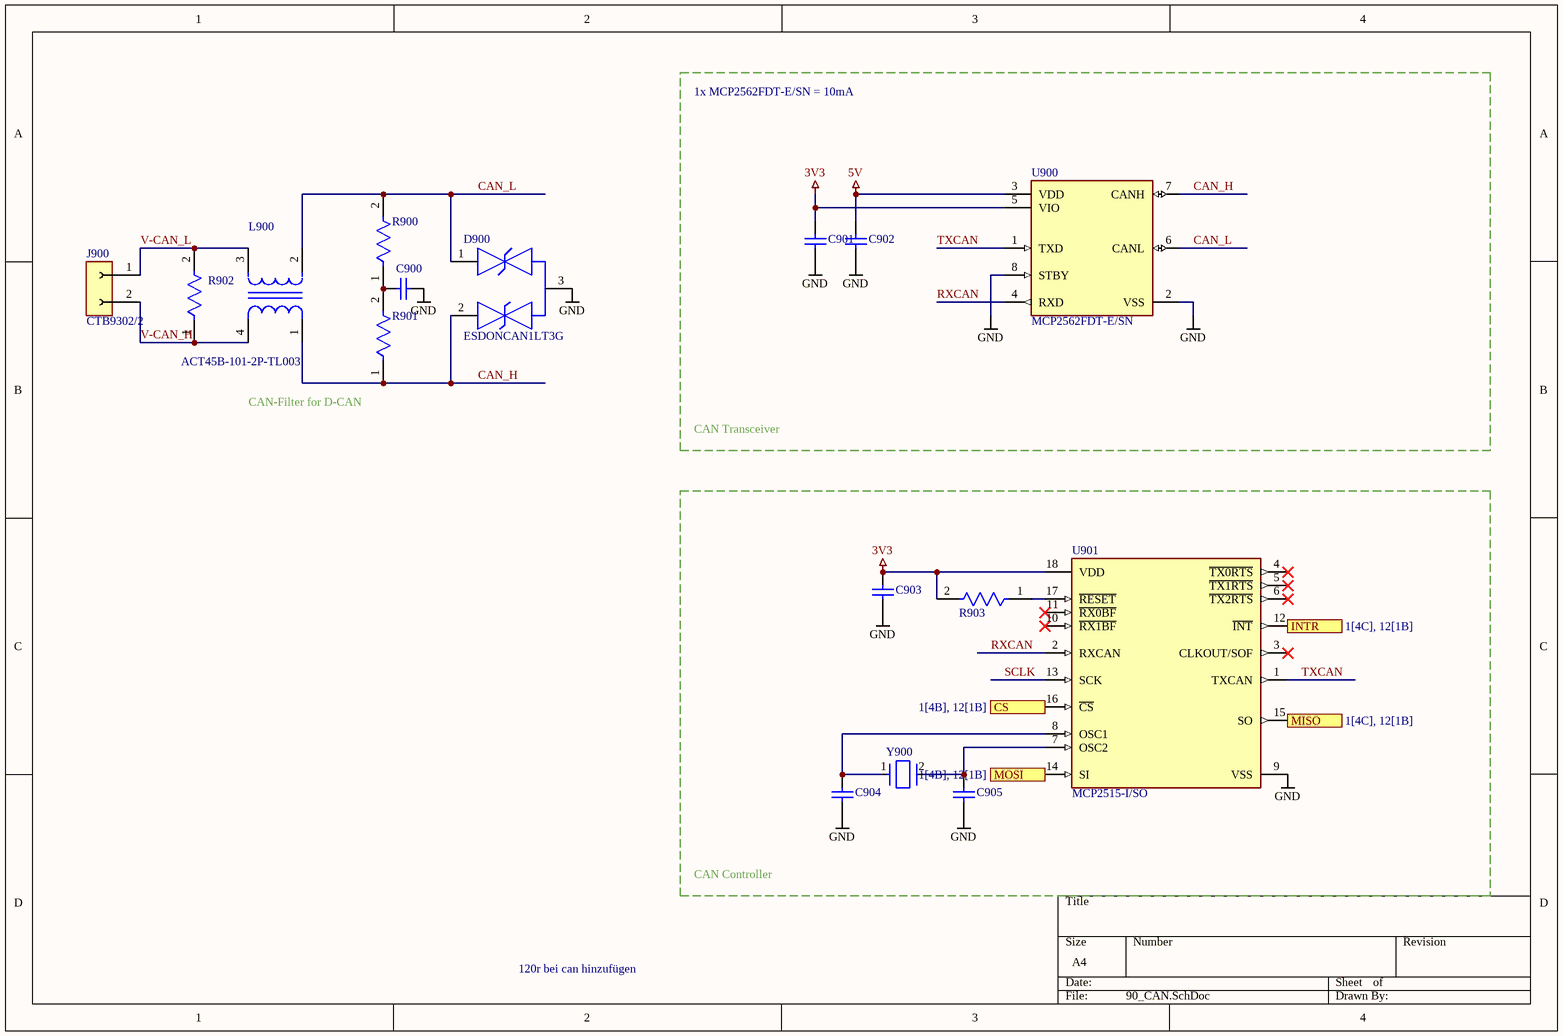
[diagram p4: 90_CAN.SchDoc]

### Parts
C900  GRM188R71H472KA01D  [CAPC1608X90X35ML10T15]  (value not drawn)
C901  GRM188R71H104KA93D  [CAPC1608X90X35ML10T15]  (value not drawn)
C902  GRM188R71H104KA93D  [CAPC1608X90X35ML10T15]  (value not drawn)
C903  GRM188R71H104KA93D  [CAPC1608X90X35ML10T15]  (value not drawn)
C904  GRM1885C1H220JA01D  [CAPC1608X90X35ML10T15]  (value not drawn)
C905  GRM1885C1H220JA01D  [CAPC1608X90X35ML10T15]  (value not drawn)
D900  ESDONCAN1LT3G  [FP-318-MFG]
J900  CTB9302/2  [CTB9302-2]
L900  ACT45B-101-2P-TL003  [FP-ACT45B-MFG]
R900  CRCW06034K70FKEA  [FP-CRCW0603-e3-IPC_A]  (value not drawn)
R901  CRCW06034K70FKEA  [FP-CRCW0603-e3-IPC_A]  (value not drawn)
R902  CRCW0603120RFKEA  [FP-CRCW0603-e3-MFG]  (value not drawn)
R903  CRCW06034K70FKEA  [FP-CRCW0603-e3-IPC_A]  (value not drawn)
U900  MCP2562FDT-E/SN  [FP-C04-057-SN-MFG]
U901  MCP2515-I/SO  [FP-C04-051-MFG]
Y900  ABLS-16.000MHZ-K4T  [FP-ABLS-MFG]  (value not drawn)

### Blocks framed on the sheet
CAN Controller: C903-C905 R903 U901 Y900

### Ports
CS (in, see 1[4B], 12[1B]), INTR (see 1[4C], 12[1B]), MISO (see 1[4C], 12[1B]), MOSI (see 1[4B], 12[1B])

### Nets
3V3: C901.2 C903.2 R903.2 U900.5(VIO) U901.18(VDD)
5V: C902.2 U900.3(VDD)
GND: C900.2 C901.1 C902.1 C903.1 C904.1 C905.1 D900.3 U900.2(VSS) U900.8(STBY) U901.9(VSS)
CAN_H: D900.2 L900.1 R901.1 U900.7(CANH)
CAN_L: D900.1 L900.2 R900.2 U900.6(CANL)
RXCAN: U900.4(RXD) U901.2(RXCAN)
SCLK: U901.13(SCK)
TXCAN: U900.1(TXD) U901.1(TXCAN)
V-CAN_H: J900.2 L900.4 R902.1
V-CAN_L: J900.1 L900.3 R902.2
NetC900_1: C900.1 R900.1 R901.2
NetC904_2: C904.2 U901.8(OSC1) Y900.1
NetC905_2: C905.2 U901.7(OSC2) Y900.2
NetR903_1: R903.1 U901.17(~{RESET})
NetU901_12: U901.12(~{INT}) ; port INTR
NetU901_14: U901.14(SI) ; port MOSI
NetU901_15: U901.15(SO) ; port MISO
NetU901_16: U901.16(~{CS}) ; port CS

Not connected (* = marked no-connect by the designer): U901 3(CLKOUT/SOF)* 4(~{TX0RTS})* 5(~{TX1RTS})* 6(~{TX2RTS})* 10(~{RX1BF})* 11(~{RX0BF})*

### Notes on the sheet
- 1x MCP2562FDT-E/SN = 10mA
- (near R901) CAN-Filter for D-CAN
- CAN Transceiver
- 120r bei can hinzufügen

### Library data of the parts
C900 = CMP-2006-02924-1: Manufacturer: Murata; Part Number: GRM188R71H472KA01D
C901-C903 = CMP-2100-03643-1: Chip Capacitor, 0.1 uF, +/- 10%, 50 V, -55 to 125 degC, 0603 (1608 Metric), RoHS, Tape and Reel; Manufacturer: Murata; Dielectric Material: Ceramic; Voltage Rating: 50V; Capacitance: 100nF; Dielectric: X7R; Insulation Resistance: 10GR; Case Code (Metric): 1608; Lead Free: LeadFree; Depth: 0.8mm; Number of Pins: 2; Radiation Hardening: No; Case/Package: 0603; Manufacturer URL: http://www.murata.com/; Packaging: TapeandReel; Length: 1.6mm; Contact Plating: Tin; Datasheet URL: http://psearch.en.murata.com/capacitor/product/GRM188R71H104KA93%23.pdf; Tolerance: 10%; Case Code (Imperial): 0603; Min Operating Temperature: -55degC; RoHSCompliant: true; Voltage: 50V; Termination: SMD/SMT; Mount: SurfaceMount; Material: Ceramic; Package Quantity: 1; Height: 0.8mm; Thickness: 0.035inch; REACH SVHC: NoSVHC; Max Operating Temperature: 125degC; Width: 0.8mm; Package Reference: 0603; Voltage Rating (DC): 50V; Datasheet Version: 42675.0; Package Description: 2-Pin Surface Mount Device, Body 1.6 x 0.8 mm
C904 C905 = CMP-2000-04945-1: Chip Capacitor, 22 pF, +/- 5%, 50 V, -55 to 125 degC, 0603 (1608 Metric), RoHS, Tape and Reel; Manufacturer: Murata; Capacitance: 22pF; Rated Voltage: 50V; Dielectric: C0G; Manufacturer URL: http://www.murata.com/; Datasheet Version: Jul-06; Package Reference: 603; Tolerance (%): ±5%; Case Size/Dimension: 0603; Package Description: 2-Pin Surface Mount Device, Body 1.6 x 0.8 mm; Datasheet URL: https://datasheet.ciiva.com/11786/0900766b807a1cab-11786398.pdf
D900 = CMP-00278-29932846-1: ESDONCAN1LT3G ESD Suppressor TVS Dual Bi-Dir 3-Pin SOT-23 T/R - Tape and Reel; Manufacturer Lifecycle Status: ACTIVE; Number of Bidirectional Channels: 2; Power Line Protection: No; Peak Pulse Current: 3A; Reverse Standoff Voltage: 24V; Min Breakdown Voltage: 26.2V; Clamping Voltage: 50V; Number of Pins: 3; RoHS: Compliant; Mount: Surface Mount; Packaging: Tape & Reel (TR); Min Operating Temperature: -55°C; Lifecycle Status: Production; Max Operating Temperature: 150°C; Composition: Zener; NexarPartId: 29932846; Case/Package: TO-236-3; Lead Free: Lead Free
J900 = CTB9302-2: CTB9302/2 - Stiftleiste - 2-pol, RM 5 mm, 0°
L900 = CMP-08256-000007-1: CMC 100UH 150MA 2LN SMD AEC-Q200; Manufacturer: TDK; Tolerance: +50/-30%; Rms Current: 0.15A; Automotive Grade: Grade 0; Series Resistance: 2Ω; Test Frequency: 100kHz; Impedance At Frequency: 5800Ω @ 10MHz; ComponentLink2URL: https://product.tdk.com/info/en/catalog/datasheets/cmf_automotive_signal_act45b_en.pdf; Octopart: https://octopart.com/act45b-101-2p-tl003-tdk-11353565; Lead Free: Yes; Manufacturer Part Number: ACT45B-101-2P-TL003; Mouser Description: Common Mode Chokes / Filters 5000ohms 100uH 150mA CAN-BUS AEC-Q200; Device Class L1: Passive Components; Automotive: Yes; Temperature Range High: +150°C; Device Class L2: EMI / RFI Components; ComponentLink2Description: Datasheet; Package: ACT45B; Category: Ind; Value: 100uH; RoHS: TRUE; Temperature: -40°C to +150°C; Height: 3mm; Inductance: 100uH; Digikey Description: CMC 100UH 150MA 2LN SMD AEC-Q200; Composition: Wirewound; Device Class L3: Common Mode Chokes; Temperature Range Low: -40°C
R900 R901 R903 = CMP-1666-00019-3: RES Thick Film, 4.7kΩ, 1%, 0.1W, 100ppm/°C, 0603; Resistance: 4.7kR; Voltage Rating: 75V; Power Rating: 100mW; Case Code (Metric): 1608; Military Standard: Not; Packaging: Tape and Reel; Termination: SMD/SMT; Temperature Coefficient: 100ppm/°C; Lead Free: Lead Free; Length: 1.55mm; Width: 0.85mm; Height: 0.45mm; Depth: 0.85mm; Weight: 7.1E-05oz; Case Code (Imperial): 0603; Contact Plating: Tin; Case/Package: 0603; Max Operating Temperature: 155°C; Mount: Surface Mount; Tolerance: 1%; Min Operating Temperature: -55°C; Package Quantity: 5000; Voltage Rating (DC): 75V; Composition: Thick Film
R902 = CMP-1666-00020-3: RES Thick Film, 120Ω, 1%, 0.1W, 100ppm/°C, 0603; Power Rating: 100mW; Working Voltage: 75V; Resistance: 120R; RoHS Compliant: Yes; Lead Free: Lead Free; Termination: SMD/SMT; Radiation Hardening: No; Case Code (Imperial): 0603; Series: CRCW; Resistance Tolerance: 1%; Number of Terminations: 2; Tolerance: 1%; Max Operating Temperature: 155°C; Contact Plating: Tin; Package Quantity: 10; Max Power Dissipation: 100mW; Case Code (Metric): 1608; Weight: 7.1E-05oz; Packaging: Tape and Reel; Mount: Surface Mount; Military Standard: Not; Construction: Rectangular; Features: Automotive AEC-Q200; Depth: 0.85mm; Min Operating Temperature: -55°C; Case/Package: 0603; Height: 0.45mm; Voltage Rating (DC): 75V; Width: 0.033inch; Technology: THICK FILM; Length: 1.55mm; Voltage Rating: 75V; Temperature Coefficient: 100ppm/°C; Resistor Type: Thick Film
U900 = CMP-06279-000005-1: IC TRANSCEIVER 1/1 8SOIC; Operating Supply Current: 70mA; Data Rate: 8Mbps; Number of Transceivers: 1; Receiver Hysteresis: 200mV; Max Supply Voltage: 5.5V; Min Supply Voltage: 4.5V; Weight: 0.019048oz; Package Quantity: 3300; Case/Package: SOIC; Mount: Surface Mount; Max Operating Temperature: 125°C; Min Operating Temperature: -40°C; Packaging: Tape and Reel; Number of Pins: 8
U901 = CMP-0186-00133-3: IC CAN CONTROLLER W/SPI 18SOIC; Manufacturer: Microchip; Min Supply Voltage: 2.7V; Max Supply Voltage: 5.5V; Standoff Height: 0.1mm; Nominal Supply Current: 10mA; Interface: SPI,CAN; Lead Free: Yes; Digikey Description: IC CAN CONTROLLER W/SPI 18SOIC; Category: IC; RoHS: TRUE; Manufacturer Part Number: MCP2515-I/SO; ComponentLink2URL: http://ww1.microchip.com/downloads/en/DeviceDoc/MCP2515-Stand-Alone-CAN-Controller-with-SPI-20001801J.pdf; Mouser Description: CAN Interface IC W/ SPI Interface; Device Class L2: Interface ICs; Package: C04-051; Automotive: No; Function: Controller; Octopart: https://octopart.com/mcp2515-i%2Fso-microchip-430187; Temperature: -40°C to +85°C; Ipc Land Pattern Name: SOIC127P1030X265-18; Ambient Temperature Range Low: -65°C; Height: 2.65mm; Device Class L1: Integrated Circuits (ICs); Ambient Temperature Range High: +125°C; Footprint Url: http://ww1.microchip.com/downloads/en/DeviceDoc/18L_SOIC_Wide_7.50_SO_C04-0051D.pdf; Temperature Range Low: -40°C; Device Class L3: Controllers; Temperature Range High: +85°C; ComponentLink2Description: Datasheet
Y900 = CMP-27762-000003-1: CRYSTAL 16.0000MHZ 18PF SMD; Manufacturer: Abracon; Frequency: 16MHz; Stability: 50ppm; Tolerance: 30ppm; Standoff Height: 0mm; Esr: 40Ω; ComponentLink2URL: https://abracon.com/Resonators/abls.pdf; Temperature Range High: +125°C; Package: ABLS; Device Class L3: Crystals; Temperature: -40°C to +125°C; Load Capacitance: 18pF; Device Class L2: Crystals / Oscillators; Mouser Description: Crystal 16MHz ±30ppm (Tol) ±50ppm (Stability) 18pF FUND 40Ohm 2-Pin HC-49/US SMD T/R; Category: Crys; ComponentLink2Description: Datasheet; Manufacturer Part Number: ABLS-16.000MHZ-K4T; Series: ABLS; Automotive: No; Octopart: https://octopart.com/abls-16.000mhz-k4t-abracon-18618626; RoHS: TRUE; Digikey Description: CRYSTAL 16.0000MHZ 18PF SMD; Temperature Range Low: -40°C; Lead Free: Yes; Height: 4.3mm; Device Class L1: Passive Components

## Nets that join several sheets
3V3: 100_PowerSupply (7 pins), 90_CAN (5 pins)
5V: 10_Speed (22 pins), 50_Distance (35 pins), 100_PowerSupply (7 pins), 90_CAN (C902.2 U900.3)
GND: 00_Overview (R000.2 R001.2 R002.2 R003.2), 10_Speed (27 pins), 50_Distance (65 pins), 100_PowerSupply (30 pins), 90_CAN (10 pins)
KL30i: 00_Overview (R004.2 R005.2 R006.2 R007.2), 100_PowerSupply (12 pins)
~{DIG-RST}: 10_Speed (5 pins), 50_Distance (10 pins)
NetU100_18: 10_Speed (5 pins), 50_Distance (10 pins)
NetU100_19: 10_Speed (5 pins), 50_Distance (10 pins)